# EasyEDA schematic SchematicJSON.json
TITLE: Invaders From Space; REV: 1.0; Date: 2024-07-14; Sheet: 1/1; Drawn By: alanasch0; Company: Your Company
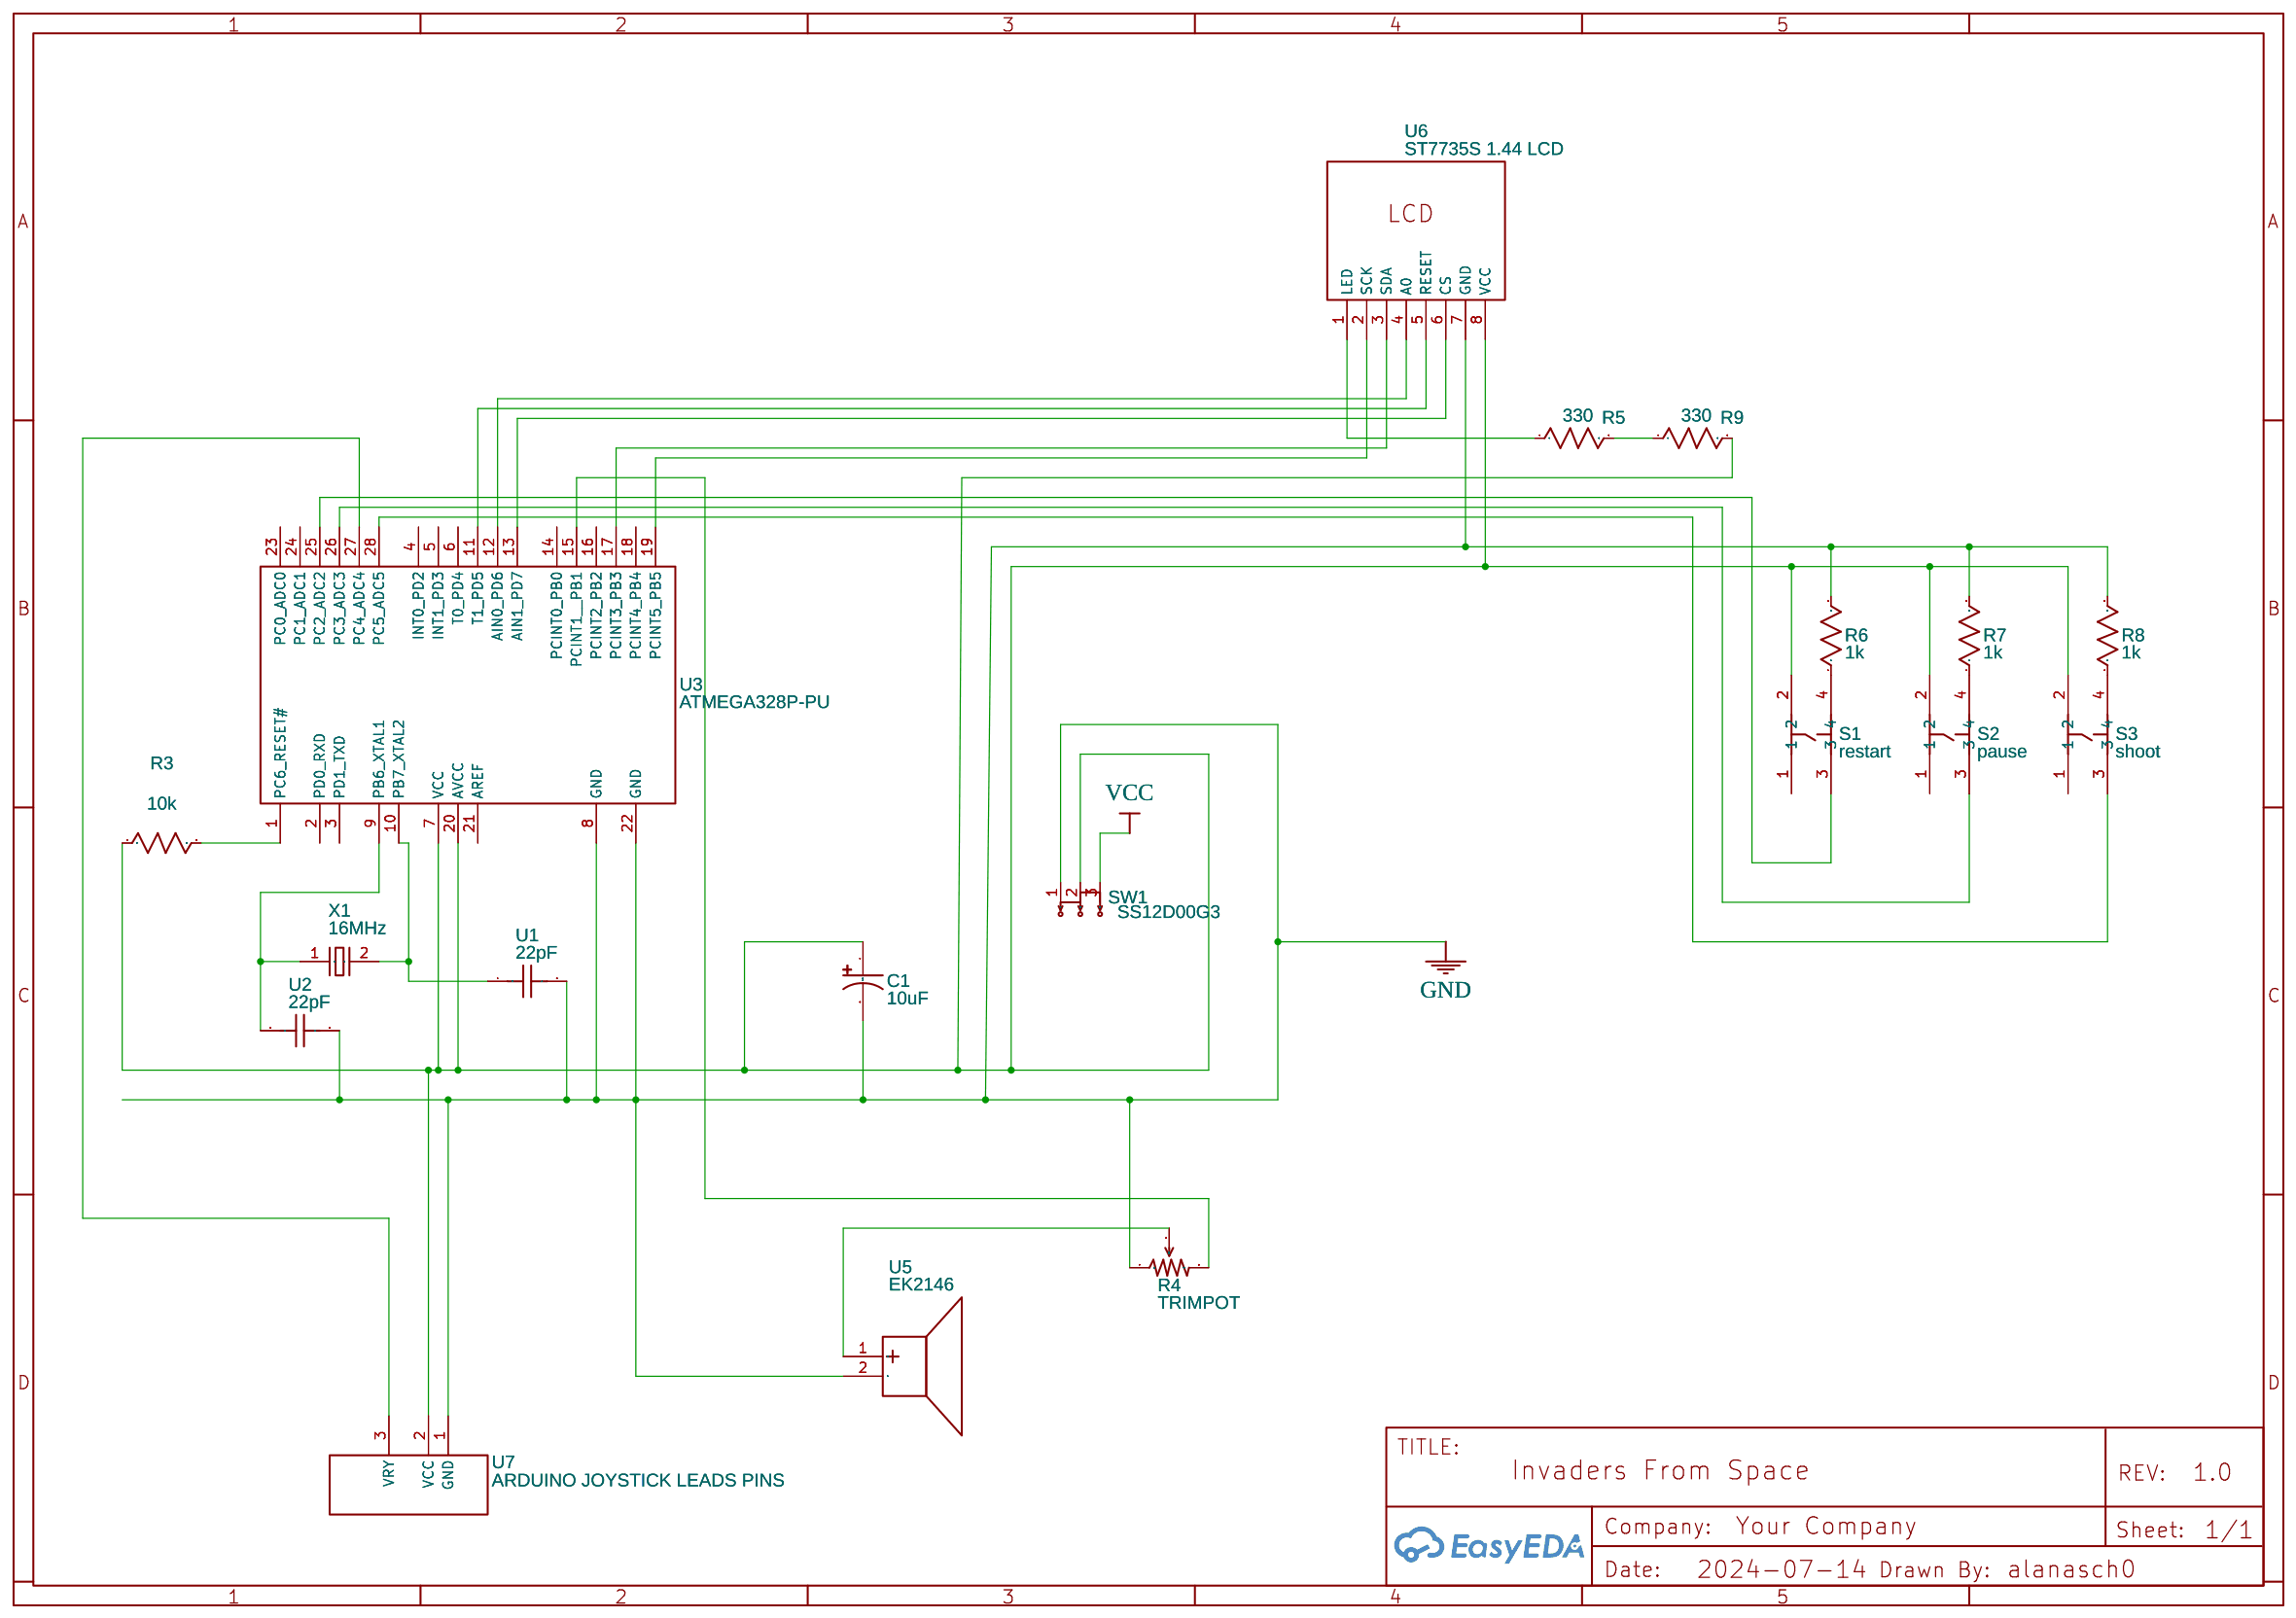
[diagram p0: schematic sheet]

## Parts
C1  10uF  [CAP-TH_BD10.0-P5.00-D1.0-FD]
R3  10k  [RESISTOR HOLES]
R4  TRIMPOT  [3386U]
R5  330  [RESISTOR HOLES]
R6  1k  [RESISTOR HOLES]
R7  1k  [RESISTOR HOLES]
R8  1k  [RESISTOR HOLES]
R9  330  [RESISTOR HOLES]
S1  restart  [SOFT TACTILE BUTTON 8X8 (ADAFRUIT 3101)]
S2  pause  [SOFT TACTILE BUTTON 8X8 (ADAFRUIT 3101)]
S3  shoot  [SOFT TACTILE BUTTON 8X8 (ADAFRUIT 3101)]
SW1  SS12D00G3  [SW-TH_SS-12D01-GX]
U1  22pF  [CAP-TH_L4.0-W2.6-P2.5-D0.5]
U2  22pF  [CAP-TH_L4.0-W2.6-P2.5-D0.5]
U3  ATMEGA328P-PU  [DIP-28_L34.6-W7.3-P2.54-LS10.2-BL]
U5  EK2146  [PIEZO_EK2146]
U6  ST7735S 1.44 LCD  [ST7735144LCD]
U7  ARDUINO JOYSTICK LEADS PINS  [ARDUINO JOYSTICK LEADS]
X1  16MHz  [HC-49US_L11.0-W4.6-P4.88]

## Library data of the parts
C1 = NFA-400VB10-M-10*20: Contributor: LCSC; Supplier: LCSC; Supplier Part: C350058; Manufacturer: SAMYOUNG(韩国三莹); Manufacturer Part: NFA 400V10 M 10*20; JLCPCB Part Class: Extended Part
R3 R5-R9 = R_0603_US: Contributor: LCEDA_Lib
R4 = TRIMPOT: Contributor: SparkFun; Package Display: No
S1-S3 = Soft Tactile Button 8x8 (Adafruit 3101): Manufacturer: Adafruit; Manufacturer Part: 3101; Supplier: Mouser; Supplier Part: 485-3101; link: https://www.mouser.de/ProductDetail/Adafruit/3101?qs=IP4CA2YhK0BHSMghUFBXjQ%3D%3D; Contributor: retrust
SW1 = SS12D00G3: Contributor: lcsc; Supplier: LCSC; Supplier Part: C9900018735; Manufacturer: null; JLCPCB Part Class: Extended Part
U1 U2 = K220J15C0GF53L2: Contributor: LCSC; Supplier: LCSC; Supplier Part: C1620142; Manufacturer: VISHAY(威世); JLCPCB Part Class: Extended Part
U3 = ATMEGA328P-PU: sourceId: Oic6oiASL; Contributor: LCSC; Supplier: LCSC; Manufacturer: MICROCHIP(美国微芯); Supplier Part: C33901; JLCPCB Part Class: Extended Part
U5 = EK2146: Manufacturer: Gikfun; Supplier: Amazon; Supplier Part: Piezo_EK2146; Contributor: winstontsmith57
U6 = ST7735S 1.44 LCD: Contributor: AntonLynnyk
U7 = ARDUINO JOYSTICK LEADS PINS: Contributor: alanasch0
X1 = AS-16.000-18: Contributor: lcsc; Supplier: LCSC; Supplier Part: C1669706; Manufacturer: RALTRON(美国纬创电子); JLCPCB Part Class: Extended Part

## Nets
GND: C1.2 R4.1(CCW) R6.2 R7.2 R8.2 SW1.1 U1.2 U2.2 U3.8(GND) U3.22(GND) U5.2 U6.7(GND) U7.1(GND)
VCC: SW1.3
Net-(C1-1): C1.1 R3.1 R9.2 S1.2 S2.2 S3.2 SW1.2 U3.7(VCC) U3.20(AVCC) U6.8(VCC) U7.2(VCC)
Net-(R3-2): R3.2 U3.1(PC6 RESET#)
Net-(R4-2): R4.2(WIPER) U5.1
Net-(R4-3): R4.3(CW) U3.15(PCINT1  PB1)
Net-(R5-1): R5.1 U6.1(LED)
Net-(R5-2): R5.2 R9.1
Net-(R6-1): R6.1 S1.4
Net-(R7-1): R7.1 S2.4
Net-(R8-1): R8.1 S3.4
Net-(S1-3): S1.3 U3.25(PC2 ADC2)
Net-(S2-3): S2.3 U3.26(PC3 ADC3)
Net-(S3-3): S3.3 U3.28(PC5 ADC5)
Net-(U1-1): U1.1 U3.10(PB7 XTAL2) X1.2
Net-(U2-1): U2.1 U3.9(PB6 XTAL1) X1.1
Net-(U3-11): U3.11(T1 PD5) U6.5(RESET)
Net-(U3-12): U3.12(AIN0 PD6) U6.4(A0)
Net-(U3-13): U3.13(AIN1 PD7) U6.6(CS)
Net-(U3-17): U3.17(PCINT3 PB3) U6.3(SDA)
Net-(U3-19): U3.19(PCINT5 PB5) U6.2(SCK)
Net-(U3-27): U3.27(PC4 ADC4) U7.3(VRY)

Not connected (* = marked no-connect by the designer): S1 1; S2 1; S3 1; U3 2(PD0 RXD) 3(PD1 TXD) 4(INT0 PD2) 5(INT1 PD3) 6(T0 PD4) 14(PCINT0 PB0) 16(PCINT2 PB2) 18(PCINT4 PB4) 21(AREF) 23(PC0 ADC0) 24(PC1 ADC1)
